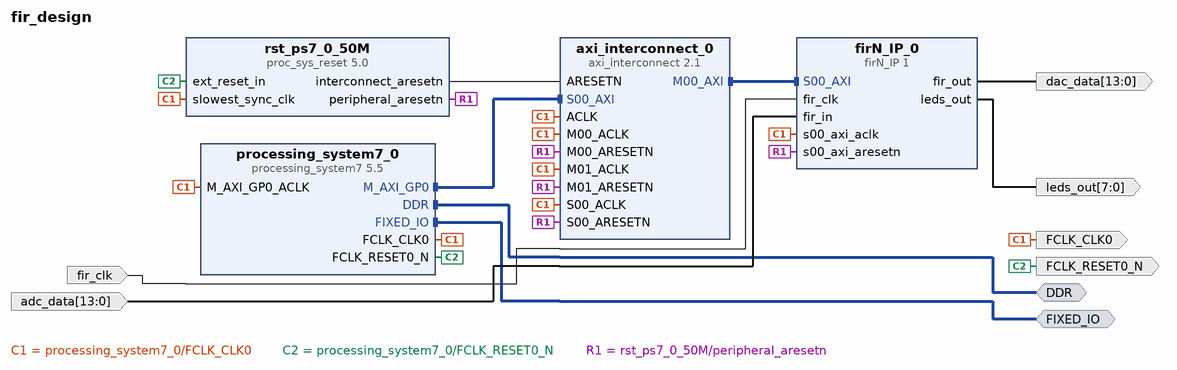
[diagram p0: block diagram of the top level]
# Vivado block design fir_design, xc7z010clg400-1, Vivado 2017.3
create_bd_design fir_design

create_bd_intf_port -mode Master -vlnv xilinx.com:interface:ddrx_rtl:1.0 DDR
create_bd_intf_port -mode Master -vlnv xilinx.com:display_processing_system7:fixedio_rtl:1.0 FIXED_IO
create_bd_port -dir O -type clk FCLK_CLK0
create_bd_port -dir O -type rst FCLK_RESET0_N
create_bd_port -dir O -from 13 -to 0 -type data dac_data
create_bd_port -dir O -from 7 -to 0 -type data leds_out
create_bd_port -dir I -type clk fir_clk
create_bd_port -dir I -from 13 -to 0 -type data adc_data

create_bd_cell -type ip -vlnv xilinx.com:ip:axi_interconnect:2.1 axi_interconnect_0
set_property -dict {CONFIG.SYNCHRONIZATION_STAGES 2} [get_bd_cells axi_interconnect_0]
create_bd_cell -type ip -vlnv xilinx.com:ip:processing_system7:5.5 processing_system7_0
set_property -dict [list \
  CONFIG.PCW_UIPARAM_DDR_FREQ_MHZ 533.333333 \
  CONFIG.PCW_APU_PERIPHERAL_FREQMHZ 666.666666 \
  CONFIG.PCW_FPGA0_PERIPHERAL_FREQMHZ 50 \
  CONFIG.PCW_FPGA1_PERIPHERAL_FREQMHZ 50 \
  CONFIG.PCW_M_AXI_GP0_FREQMHZ 50 \
  CONFIG.PCW_GP0_EN_MODIFIABLE_TXN 0 \
  CONFIG.PCW_GP1_EN_MODIFIABLE_TXN 0 \
  CONFIG.PCW_PERIPHERAL_BOARD_PRESET None \
  CONFIG.PCW_PRESET_BANK1_VOLTAGE {LVCMOS 3.3V} \
  CONFIG.PCW_UIPARAM_DDR_PARTNO {MT41J128M8 JP-125} \
  CONFIG.PCW_QSPI_PERIPHERAL_ENABLE 0 \
  CONFIG.PCW_ENET0_PERIPHERAL_ENABLE 0 \
  CONFIG.PCW_SD0_PERIPHERAL_ENABLE 0 \
  CONFIG.PCW_UART1_PERIPHERAL_ENABLE 0 \
  CONFIG.PCW_USB0_PERIPHERAL_ENABLE 0 \
  CONFIG.PCW_GPIO_MIO_GPIO_ENABLE 0 \
] [get_bd_cells processing_system7_0]
# 327 more settings of processing_system7_0 are not shown: defaults, MIO pin electricals, DDR timing, and values the tool derives
create_bd_cell -type ip -vlnv xilinx.com:ip:proc_sys_reset:5.0 rst_ps7_0_50M
create_bd_cell -type ip -vlnv fj:user:firN_IP:1 firN_IP_0
set_property -dict [list \
  CONFIG.FIR_DSP_NR 39 \
  CONFIG.TM 100 \
  CONFIG.OUTPUT_DATA_WIDTH 14 \
  CONFIG.SRC_COEF_MAG 24 \
  CONFIG.FIR_COEF_MAG 24 \
  CONFIG.SRC_DSP_NR 20 \
] [get_bd_cells firN_IP_0]

# ---- connections ----

connect_bd_intf_net [get_bd_intf_pins processing_system7_0/M_AXI_GP0] [get_bd_intf_pins axi_interconnect_0/S00_AXI]
connect_bd_intf_net [get_bd_intf_pins axi_interconnect_0/M00_AXI] [get_bd_intf_pins firN_IP_0/S00_AXI]
connect_bd_intf_net [get_bd_intf_ports DDR] [get_bd_intf_pins processing_system7_0/DDR]
connect_bd_intf_net [get_bd_intf_ports FIXED_IO] [get_bd_intf_pins processing_system7_0/FIXED_IO]
connect_bd_net [get_bd_pins processing_system7_0/FCLK_CLK0] \
  [get_bd_ports FCLK_CLK0] [get_bd_pins processing_system7_0/M_AXI_GP0_ACLK] [get_bd_pins rst_ps7_0_50M/slowest_sync_clk] \
  [get_bd_pins firN_IP_0/s00_axi_aclk] [get_bd_pins axi_interconnect_0/ACLK] [get_bd_pins axi_interconnect_0/S00_ACLK] \
  [get_bd_pins axi_interconnect_0/M00_ACLK] [get_bd_pins axi_interconnect_0/M01_ACLK]
connect_bd_net [get_bd_pins processing_system7_0/FCLK_RESET0_N] [get_bd_ports FCLK_RESET0_N] [get_bd_pins rst_ps7_0_50M/ext_reset_in]
connect_bd_net [get_bd_pins rst_ps7_0_50M/interconnect_aresetn] [get_bd_pins axi_interconnect_0/ARESETN]
connect_bd_net [get_bd_pins rst_ps7_0_50M/peripheral_aresetn] \
  [get_bd_pins firN_IP_0/s00_axi_aresetn] [get_bd_pins axi_interconnect_0/S00_ARESETN] \
  [get_bd_pins axi_interconnect_0/M00_ARESETN] [get_bd_pins axi_interconnect_0/M01_ARESETN]
connect_bd_net [get_bd_pins firN_IP_0/fir_out] [get_bd_ports dac_data]
connect_bd_net [get_bd_pins firN_IP_0/leds_out] [get_bd_ports leds_out]
connect_bd_net -net adc_clk_1 [get_bd_ports fir_clk] [get_bd_pins firN_IP_0/fir_clk]
connect_bd_net [get_bd_ports adc_data] [get_bd_pins firN_IP_0/fir_in]

# ---- address map ----
assign_bd_address -offset 0x43C00000 -range 4M -target_address_space [get_bd_addr_spaces processing_system7_0/Data] [get_bd_addr_segs firN_IP_0/S00_AXI/S00_AXI_reg]

validate_bd_design
save_bd_design
